# EAGLE design illumi-motherboard (EAGLE 6.2)
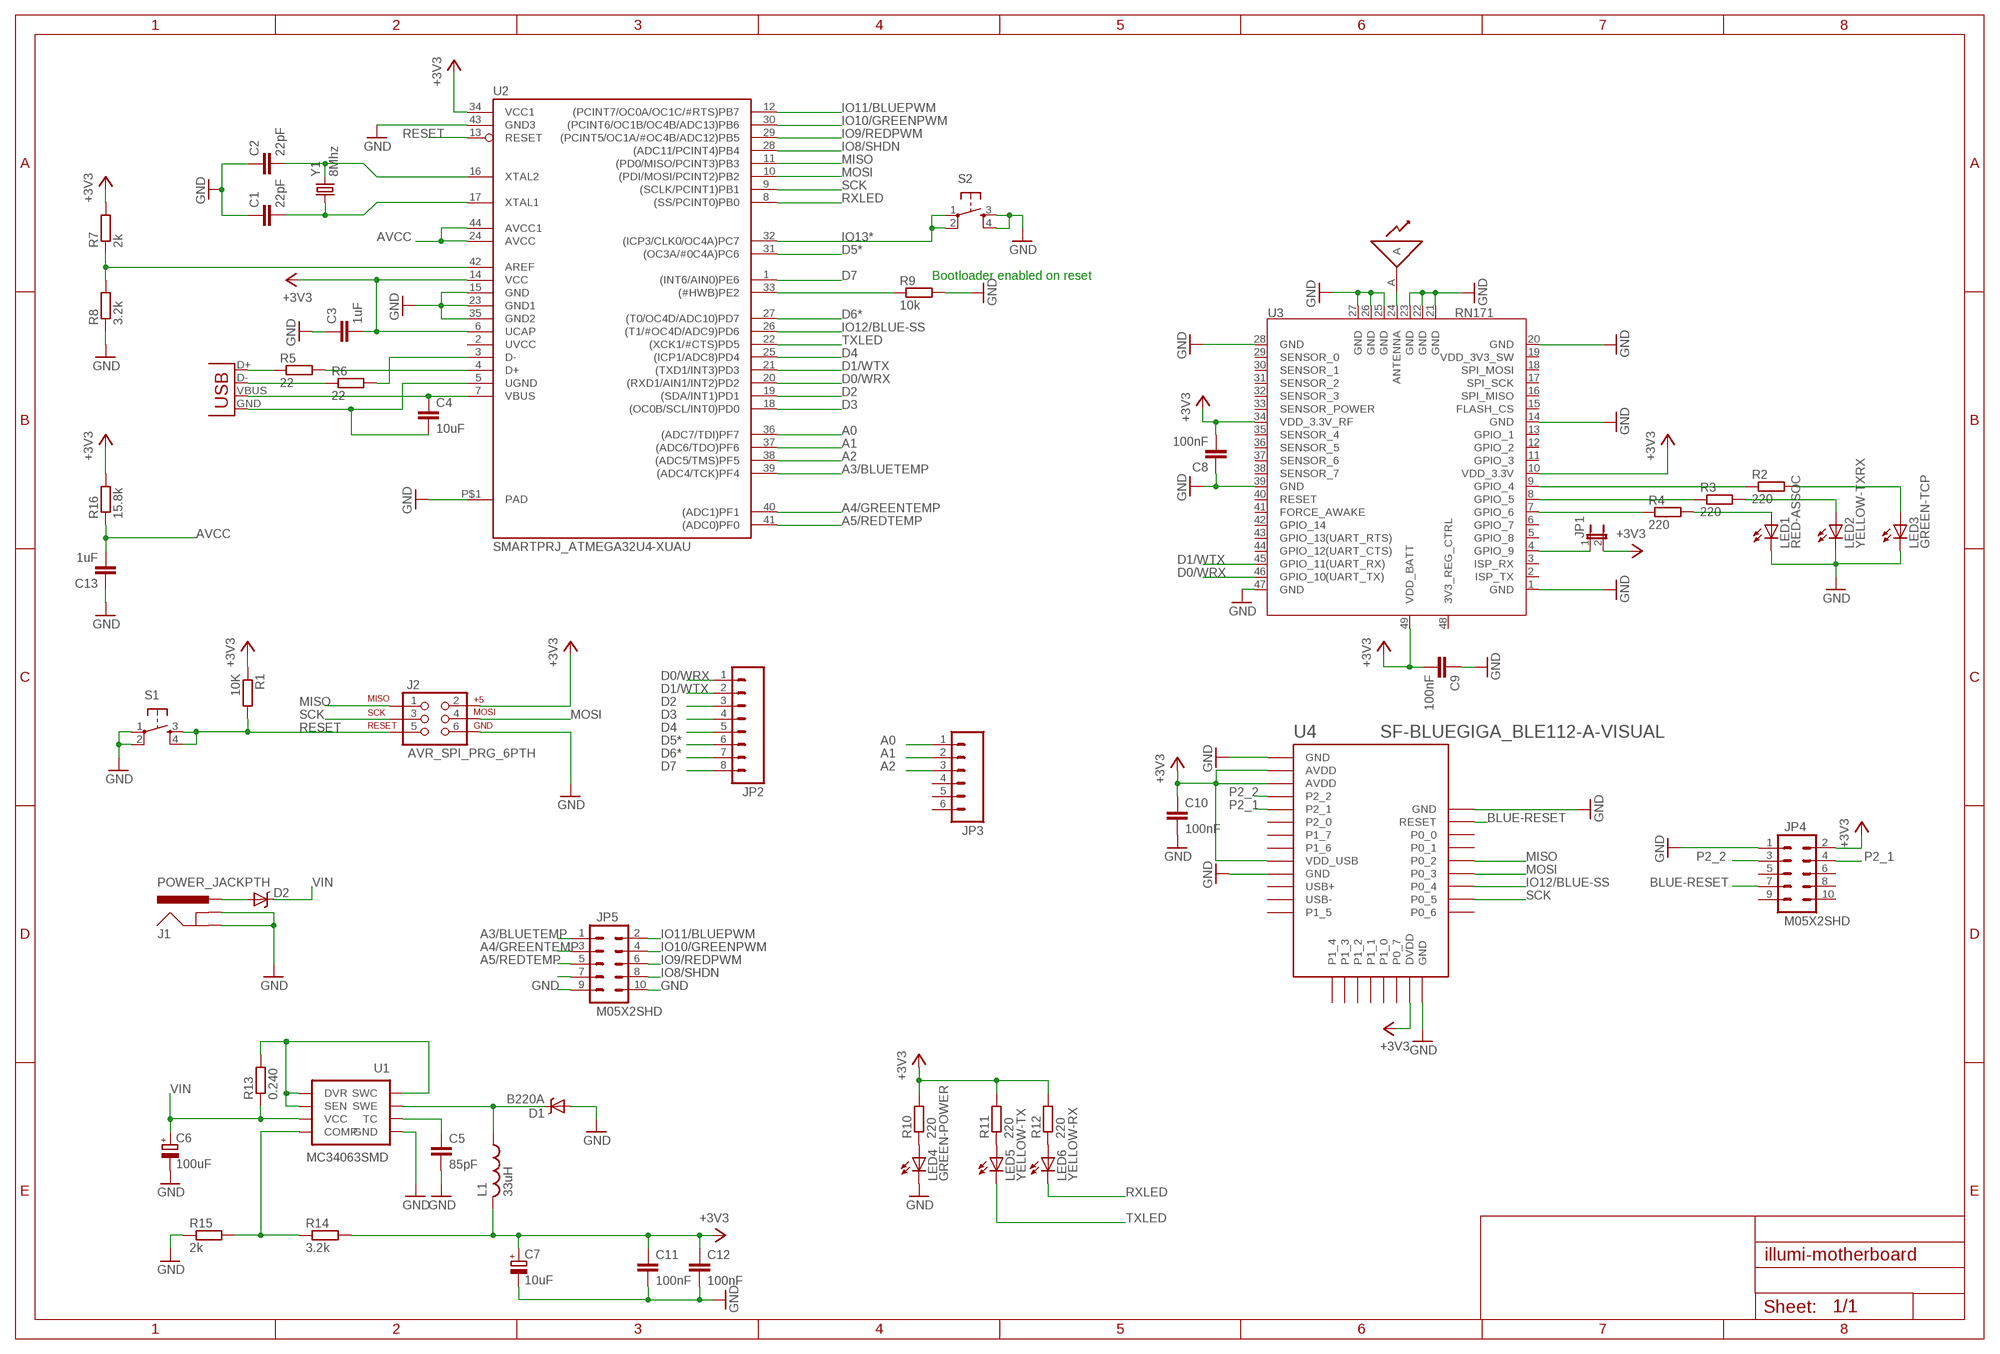
[diagram p0: schematic, sheet 1]

## Parts
A1  ANTENNAWIRE  [ANTENNA-WIRE]
C1  22pF  C-EUC0805  [C0805]
C2  22pF  C-EUC0805  [C0805]
C3  1uF  C-EUC0805  [C0805]
C4  10uF  C-EUC0805  [C0805]
C5  85pF  C-EUC0805  [C0805]
C6  100uF  CPOL-EUD  [PANASONIC_D]
C7  10uF  CPOL-EUSMCC  [SMC_C]
C8  100nF  C-EUC0805  [C0805]
C9  100nF  C-EUC0805  [C0805]
C10  100nF  C-EUC0805  [C0805]
C11  100nF  C-EUC0805  [C0805]
C12  100nF  C-EUC0805  [C0805]
C13  1uF  C-EUC0805  [C0805]
D1  B220A  DIODE-SCHOTTKYBIGPAD  [SMA-DIODE-BIG]
D2  DIODE-SCHOTTKYBIGPAD  [SMA-DIODE-BIG]
J1  POWER_JACKPTH  [POWER_JACK_PTH]
J2  AVR_SPI_PRG_6PTH  [2X3]
JP1  JUMPER-2PTH  [1X02]
JP2  M081X08  [1X08]
JP3  M06FEMALE_LOCK  [1X06_FEMALE_LOCK.010]
JP4  M05X2SHD  [2X5-SHROUDED]
JP5  M05X2SHD  [2X5-SHROUDED]
L1  33uH  L-USBOURNS-6045  [BOURNS-6045]
LED1  RED-ASSOC  LEDSML0805  [SML0805]
LED2  YELLOW-TXRX  LEDSML0805  [SML0805]
LED3  GREEN-TCP  LEDSML0805  [SML0805]
LED4  GREEN-POWER  LEDSML0805  [SML0805]
LED5  YELLOW-TX  LEDSML0805  [SML0805]
LED6  YELLOW-RX  LEDSML0805  [SML0805]
R1  10K  R-EU_R0805  [R0805]
R2  220  R-EU_R0805  [R0805]
R3  220  R-EU_R0805  [R0805]
R4  220  R-EU_R0805  [R0805]
R5  22  R-EU_R0805  [R0805]
R6  22  R-EU_R0805  [R0805]
R7  2k  R-EU_R0805  [R0805]
R8  3.2k  R-EU_R0805  [R0805]
R9  10k  R-EU_R0805  [R0805]
R10  220  R-EU_R0805  [R0805]
R11  220  R-EU_R0805  [R0805]
R12  220  R-EU_R0805  [R0805]
R13  0.240  R-EU_R1206  [R1206]
R14  3.2k  R-EU_R0805  [R0805]
R15  2k  R-EU_R0805  [R0805]
R16  15.8k  R-EU_R0805  [R0805]
S1  TAC_SWITCHB3FS  [OMRON-B3FS]
S2  TAC_SWITCHB3FS  [OMRON-B3FS]
U1  MC34063SMD  [SO08]
U2  SMARTPRJ_ATMEGA32U4-XUAU  [SMARTPRJ_TQFP44-PAD]
U3  RN171  MODULE_WIFI-RN-171  [MODULE_49P-1.27-26.67X17.78]
U4  SF-BLUEGIGA_BLE112-A-VISUAL  [SF-BLUEGIGA_BLE112-A]
X1  USB-MICROB  [USB-MICROB]
Y1  8Mhz  CRYSTALHC49US  [HC49US]

## Nets
+3V3: C3.2 C7.+ C8.2 C9.2 C10.1 C11.1 C12.1 J2.2 JP1.2 JP4.2 L1.P$2 R1.1 R7.2 R10.2 R11.2 R12.2 R14.2 R16.2 U2.6(UCAP) U2.14(VCC) U2.34(VCC1) U3.10(VDD_3.3V) U3.34(VDD_3.3V_RF) U3.49(VDD_BATT) U4.AVDD1(AVDD) U4.AVDD2(AVDD) U4.DVDD U4.VDD_USB
A0: JP3.1 U2.36((ADC7/TDI)PF7)
A1: JP3.2 U2.37((ADC6/TDO)PF6)
A2: JP3.3 U2.38((ADC5/TMS)PF5)
A3/BLUETEMP: JP5.1 U2.39((ADC4/TCK)PF4)
A4/GREENTEMP: JP5.3 U2.40((ADC1)PF1)
A5/REDTEMP: JP5.5 U2.41((ADC0)PF0)
AVCC: C13.2 R16.1 U2.24(AVCC) U2.44(AVCC1)
BLUE-RESET: JP4.7 U4.RESET
D0/WRX: JP2.1 U2.20((RXD1/AIN1/INT2)PD2) U3.46(GPIO_10(UART_TX))
D1/WTX: JP2.2 U2.21((TXD1/INT3)PD3) U3.45(GPIO_11(UART_RX))
D2: JP2.3 U2.19((SDA/INT1)PD1)
D3: JP2.4 U2.18((OC0B/SCL/INT0)PD0)
D4: JP2.5 U2.25((ICP1/ADC8)PD4)
D5*: JP2.6 U2.31((OC3A/#0C4A)PC6)
D6*: JP2.7 U2.27((T0/OC4D/ADC10)PD7)
D7: JP2.8 U2.1((INT6/AIN0)PE6)
GND: C1.1 C2.1 C3.1 C5.2 C6.- C7.- C8.1 C9.1 C10.2 C11.2 C12.2 C13.1 D1.A J1.GND J1.GNDBREAK J2.6 JP4.1 JP5.9 JP5.10 LED1.C LED2.C LED3.C LED4.C R8.1 R9.2 R15.1 S1.1 S1.2 S2.3 S2.4 U1.4(GND) U2.15(GND) U2.23(GND1) U2.35(GND2) U2.43(GND3) U2.P$1(PAD) U3.1(GND) U3.14(GND) U3.20(GND) U3.21(GND) U3.22(GND) U3.23(GND) U3.25(GND) U3.26(GND) U3.27(GND) U3.28(GND) U3.39(GND) U3.47(GND) U4.GND1(GND) U4.GND2(GND) U4.GND3(GND) U4.GND4(GND)
IO8/SHDN: JP5.8 U2.28((ADC11/PCINT4)PB4)
IO9/REDPWM: JP5.6 U2.29((PCINT5/OC1A/#OC4B/ADC12)PB5)
IO10/GREENPWM: JP5.4 U2.30((PCINT6/OC1B/OC4B/ADC13)PB6)
IO11/BLUEPWM: JP5.2 U2.12((PCINT7/OC0A/OC1C/#RTS)PB7)
IO12/BLUE-SS: U2.26((T1/#OC4D/ADC9)PD6) U4.P0_4
IO13*: S2.1 S2.2 U2.32((ICP3/CLK0/OC4A)PC7)
MISO: J2.1 U2.11((PD0/MISO/PCINT3)PB3) U4.P0_2
MOSI: J2.4 U2.10((PDI/MOSI/PCINT2)PB2) U4.P0_3
N$1: LED4.A R10.1
N$2: A1.A U3.24(ANTENNA)
N$3: R2.1 U3.9(GPIO_4)
N$4: R3.1 U3.8(GPIO_5)
N$5: R4.1 U3.7(GPIO_6)
N$6: LED1.A R4.2
N$7: LED2.A R3.2
N$8: LED3.A R2.2
N$9: C4.2 U2.5(UGND) X1.GND
N$10: R5.1 X1.D+
N$11: JP1.1 U3.4(GPIO_9)
N$12: R6.1 X1.D-
N$13: C4.1 U2.7(VBUS) X1.VBUS
N$14: R5.2 U2.4(D+)
N$15: R6.2 U2.3(D-)
N$16: R7.1 R8.2 U2.42(AREF)
N$17: LED5.A R11.1
N$18: LED6.A R12.1
N$19: JP5.7
N$20: R9.1 U2.33((#HWB)PE2)
N$21: R13.2 U1.1(SWC) U1.7(SEN) U1.8(DVR)
N$23: D1.C L1.P$1 U1.2(SWE)
N$25: C5.1 U1.3(TC)
N$26: R14.1 R15.2 U1.5(COMP)
N$29: D2.A J1.PWR
P2_1: JP4.4 U4.P2_1
P2_2: JP4.3 U4.P2_2
RESET: J2.5 R1.2 S1.3 S1.4 U2.13(RESET)
RXLED: LED6.C U2.8((SS/PCINT0)PB0)
SCK: J2.3 U2.9((SCLK/PCINT1)PB1) U4.P0_5
TXLED: LED5.C U2.22((XCK1/#CTS)PD5)
VIN: C6.+ D2.C R13.1 U1.6(VCC)
XTAL1: C1.2 U2.17(XTAL1) Y1.1
XTAL2: C2.2 U2.16(XTAL2) Y1.2
Unconnected: JP3.4 JP3.5 JP3.6 JP4.5 JP4.6 JP4.8 JP4.9 JP4.10 U3.2(ISP_TX) U3.3(ISP_RX) U3.5(GPIO_8) U3.6(GPIO_7) U3.11(GPIO_3) U3.12(GPIO_2) U3.13(GPIO_1) U3.15(FLASH_CS) U3.16(SPI_MISO) U3.17(SPI_SCK) U3.18(SPI_MOSI) U3.19(VDD_3V3_SW) U3.29(SENSOR_0) U3.30(SENSOR_1) U3.31(SENSOR_2) U3.32(SENSOR_3) U3.33(SENSOR_POWER) U3.35(SENSOR_4) U3.36(SENSOR_5) U3.37(SENSOR_6) U3.38(SENSOR_7) U3.40(RESET) U3.41(FORCE_AWAKE) U3.42(GPIO_14) U3.43(GPIO_13(UART_RTS)) U3.44(GPIO_12(UART_CTS)) U3.48(3V3_REG_CTRL) U4.P0_0 U4.P0_1 U4.P0_6 U4.P0_7 U4.P1_0 U4.P1_1 U4.P1_2 U4.P1_3 U4.P1_4 U4.P1_5 U4.P1_6 U4.P1_7 U4.P2_0 U4.USB+ U4.USB-

## Notes on the sheet
- Bootloader enabled on reset

## Power pins joined to a net without a drawn wire
UVCC: U2.2(UVCC)

## Library data of the parts
A1 = antenna:ANTENNA
C1-C5 C8-C13 = rcl:C-EU: CAPACITOR, European symbol
C6 C7 = rcl:CPOL-EU: POLARIZED CAPACITOR, European symbol
D1 D2 = diode-schottky:DIODE-SCHOTTKY
J1 = SparkFun:POWER_JACK: Power Jack This is the standard 5.5mm barrel jack for power. The PTH is the most common, proven, reliable, footprint. All others are experimental. The Slot footprint only works if the mill layer is transmitted to the PCB fab house so be warned. Spark Fun Electronics SKU : PRT-00119. Mating wall wart : TOL-00298 (and others)
J2 = SparkFun:AVR_SPI_PRG_6: AVR ISP 6 Pin This is the reduced ISP connector for AVR programming. Common on Arduino. This footprint will take up less PCB space and can be used with a 10-pin to 6-pin adapter such as SKU: BOB-08508
JP1 = SparkFun:JUMPER-2: Jumper Basic 0.1" spaced jumper. Use with breakaway headers.
JP2 = SparkFun:M08: Header 8 Standard 8-pin 0.1" header. Use with straight break away headers (SKU : PRT-00116), right angle break away headers (PRT-00553), swiss pins (PRT-00743), machine pins (PRT-00117), and female headers (PRT-00115).
JP3 = SparkFun:M06: Header 6 Standard 6-pin 0.1" header. Use with straight break away headers (SKU : PRT-00116), right angle break away headers (PRT-00553), swiss pins (PRT-00743), machine pins (PRT-00117), and female headers (PRT-00115). Molex polarized connector foot print use with SKU : PRT-08094 with associated crimp pins and housings. NOTES ON THE VARIANTS LOCK and LOCK_LONGPADS... This footprint was designed to help hold the alignment of a through-hole component (i.e. 6-pin header) while soldering it into place. You may notice that each hole has been shifted either up or down by 0.005 of an inch from it's more standard position (which is a perfectly straight line). This slight alteration caused the pins (the squares in the middle) to touch the edges of the holes. Because they are alternating, it causes a "brace" to hold the component in place. 0.005 has proven to be the perfect amount of "off-center" position when using our standard breakaway headers. Although looks a little odd when you look at the bare footprint, once you have a header in there, the alteration is very hard to notice. Also, if you push a header all the way into place, it is covered up entirely on the bottom side. This idea of altering the position of holes to aid alignment will be further integrated into the Sparkfun Library for other footprints. It can help hold any component with 3 or more connection pins.
JP4 JP5 = SparkFun:M05X2: Header 5x2 Standard 10-pin dual row 0.1" header. Commonly used with AVR-ISP. Use with Spark Fun Electronics SKU: PRT-00778
L1 = inductors:L-US: INDUCTOR, American symbol
LED1-LED6 = led:LED: LED OSRAM: - CHIPLED LG R971, LG N971, LY N971, LG Q971, LY Q971, LO R971, LY R971 LH N974, LH R974 LS Q976, LO Q976, LY Q976 LO Q996 - Hyper CHIPLED LW Q18S LB Q993, LB Q99A, LB R99A - SideLED LS A670, LO A670, LY A670, LG A670, LP A670 LB A673, LV A673, LT A673, LW A673 LH A674 LY A675 LS A676, LA A676, LO A676, LY A676, LW A676 LS A679, LY A679, LG A679 - Hyper Micro SIDELED® LS Y876, LA Y876, LO Y876, LY Y876 LT Y87S - SmartLED LW L88C, LW L88S LB L89C, LB L89S, LG L890 LS L89K, LO L89K, LY L89K LS L896, LA L896, LO L896, LY L896 - TOPLED LS T670, LO T670, LY T670, LG T670, LP T670 LSG T670, LSP T670, LSY T670, LOP T670, LYG T670 LG T671, LOG T671, LSG T671 LB T673, LV T673, LT T673, LW T673 LH T674 LS T676, LA T676, LO T676, LY T676, LB T676, LH T676, LSB T676, LW T676 LB T67C, LV T67C, LT T67C, LS T67K, LO T67K, LY T67K, LW E67C LS E67B, LA E67B, LO E67B, LY E67B, LB E67C, LV E67C, LT E67C LW T67C LS T679, LY T679, LG T679 LS T770, LO T770, LY T770, LG T770, LP T770 LB T773, LV T773, LT T773, LW T773 LH T774 LS E675, LA E675, LY E675, LS T675 LS T776, LA T776, LO T776, LY T776, LB T776 LHGB T686 LT T68C, LB T68C - Hyper Mini TOPLED® LB M676 - Mini TOPLED Santana® LG M470 LS M47K, LO M47K, LY M47K Source: http://www.osram.convergy.de LUXEON: - LUMILED® LXK2-PW12-R00, LXK2-PW12-S00, LXK2-PW14-U00, LXK2-PW14-V00 LXK2-PM12-R00, LXK2-PM12-S00, LXK2-PM14-U00 LXK2-PE12-Q00, LXK2-PE12-R00, LXK2-PE12-S00, LXK2-PE14-T00, LXK2-PE14-U00 LXK2-PB12-K00, LXK2-PB12-L00, LXK2-PB12-M00, LXK2-PB14-N00, LXK2-PB14-P00, LXK2-PB14-Q00 LXK2-PR12-L00, LXK2-PR12-M00, LXK2-PR14-Q00, LXK2-PR14-R00 LXK2-PD12-Q00, LXK2-PD12-R00, LXK2-PD12-S00 LXK2-PH12-R00, LXK2-PH12-S00 LXK2-PL12-P00, LXK2-PL12-Q00, LXK2-PL12-R00 Source: www.luxeon.com KINGBRIGHT: KA-3528ASYC Source: www.kingbright.com
R1-R8 R10-R15 = rcl:R-EU_: RESISTOR, European symbol
R9 R16 = resistor:R-EU_: RESISTOR, European symbol
S1 S2 = omron-b3fs:TAC_SWITCH: Momentary Switch Button commonly used for reset or general input. Spark Fun Electronics SKU : COM-00097
U1 = SparkFun:MC34063
U2 = atmega32u4:SMARTPRJ_ATMEGA32U4-XU
U3 = seeedstudio-rn171:MODULE_WIFI-RN-171: WIFLY GSX 802.11 b/g wireless LAN Module
U4 = ble112:SF-BLUEGIGA_BLE112-A-VISUAL: Bluetooth Low Energy single-mode module - Bluetooth 4.0, chip antenna
X1 = SparkFun:USB: USB Connectors USB-B-PTH is fully proven SKU : PRT-00139 USB-miniB is fully proven SKU : PRT-00587 USB-A-PCB is untested. USB-A-H is throughly reviewed, but untested. Spark Fun Electronics SKU : PRT-00437 USB-B-SMT is throughly reviewed, but untested. Needs silkscreen touching up. USB-A-S has not been used/tested USB-MB-H has not been used/tested
Y1 = SparkFun:CRYSTAL: Crystals Various standard crystals. Proven footprints. Spark Fun Electronics SKU : COM-00534

## Board
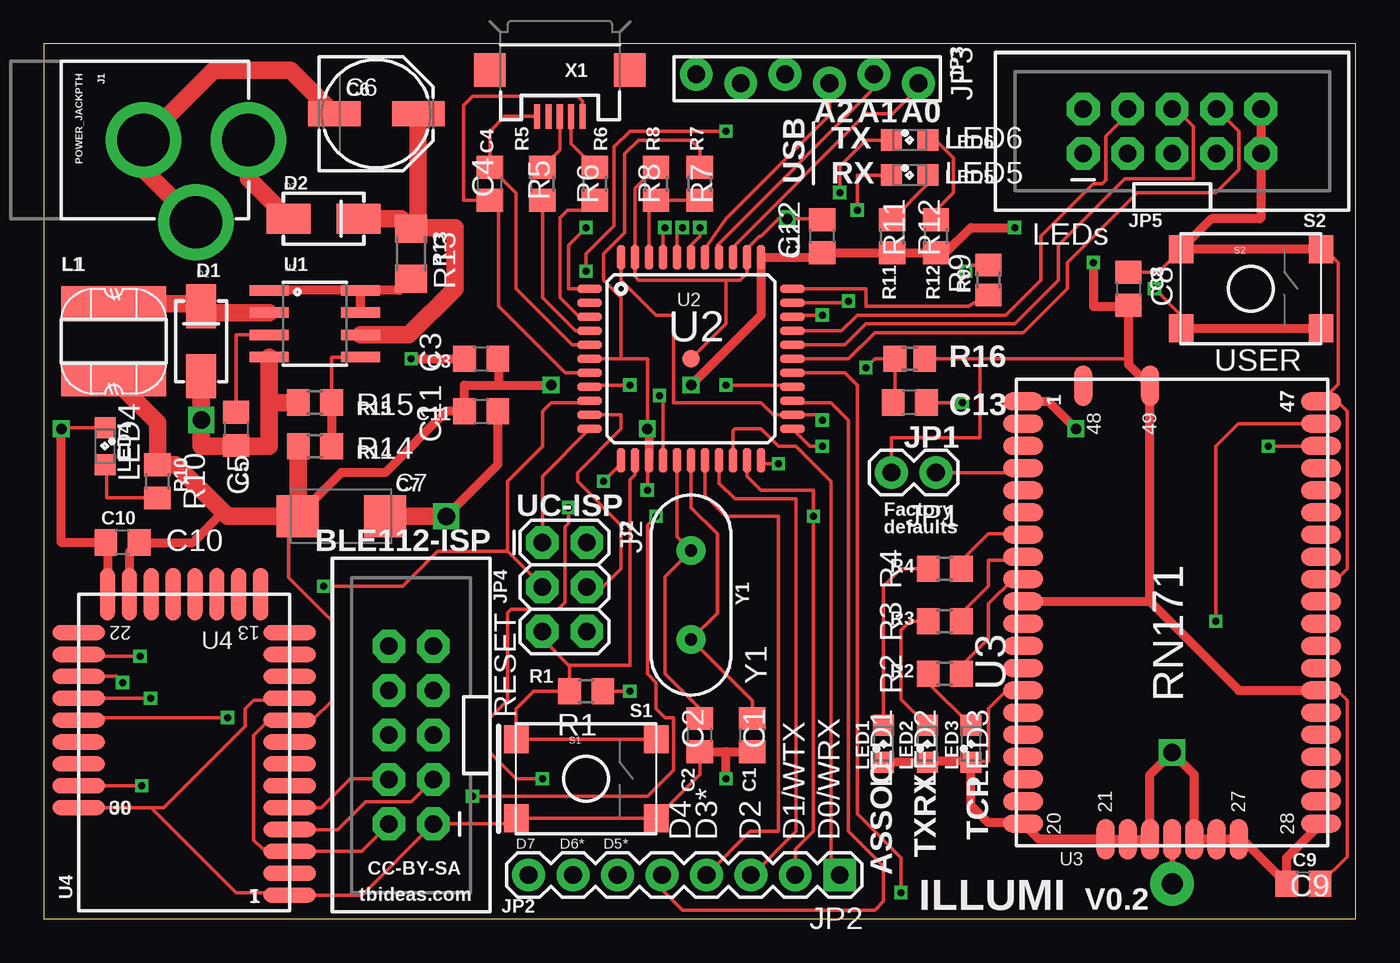
[diagram p1: board, top side]
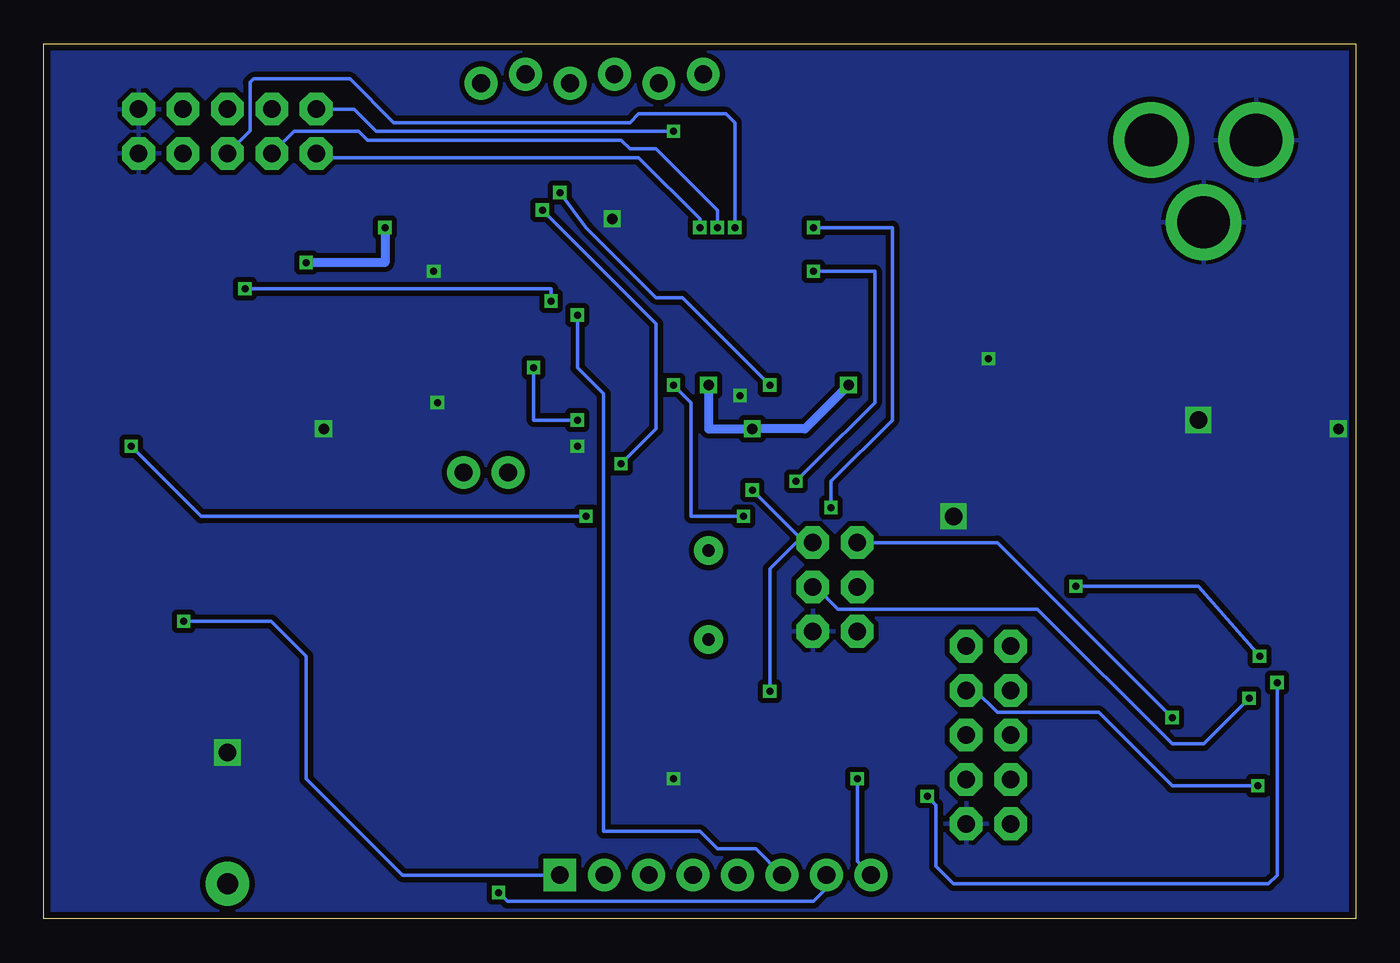
[diagram p2: board, bottom side, seen from below]

Size 75 x 50 mm. Coordinates in mm from the lower left corner, seen from the top.
Outline: 0,0 75,0 75,50 0,50 0,0
Copper layers (1*16): Top 0.0356mm / dielectric 1.5011mm / Bottom 0.0356mm
Design rules: minimum track width 6mil, minimum drill 13mil, track to track 6mil, track to pad 6mil, pad to pad 6mil, via to via 6mil, smd to smd 6mil, copper to edge 15mil, drill to drill 6mil, minimum pad ring 7mil, minimum via ring 7mil, stop-mask expansion 4mil, vias tented up to drill 0mil, thermal gap 10mil

### Footprints (pad centres in the part's own frame; a part is rotated, then mirrored left to right if it is on the bottom)
ANTENNA-WIRE = drill 1.2 pad 2.5: A 0,0
C0805 = smd 1.3 x 1.5: 1 -0.95,0; 2 0.95,0
PANASONIC_D = smd 3 x 1.4: + 2.4,0; - -2.4,0
SMC_C = smd 2.4 x 2.4: + -2.5,0; - 2.5,0
SMA-DIODE-BIG = smd 2.5 x 1.7: A -2,0; C 2,0
POWER_JACK_PTH = drill 2.997 pad 4.318: GND 0,7.7; GNDBREAK 4.7,10.7; PWR 0,13.7
2X3 = drill 1.016 pad 1.88 octagon: 1 0,0; 2 0,2.54; 3 2.54,0; 4 2.54,2.54; 5 5.08,0; 6 5.08,2.54
1X02 = drill 1.016 pad 1.88: 1 0,0; 2 2.54,0
1X08 = drill 1.016 pad 1.88 square: 1 0,0 | drill 1.016 pad 1.88: 2 2.54,0; 3 5.08,0; 4 7.62,0; 5 10.16,0; 6 12.7,0; 7 15.24,0; 8 17.78,0
1X06_FEMALE_LOCK.010 = drill 1.016 pad 1.88: 1 0,0.254; 2 2.54,-0.254; 3 5.08,0.254; 4 7.62,-0.254; 5 10.16,0.254; 6 12.7,-0.254
2X5-SHROUDED = drill 1.016 pad 1.88 octagon: 1 -1.27,5.08; 2 1.27,5.08; 3 -1.27,2.54; 4 1.27,2.54; 5 -1.27,0; 6 1.27,0; 7 -1.27,-2.54; 8 1.27,-2.54; 9 -1.27,-5.08; 10 1.27,-5.08
BOURNS-6045 = smd 2 x 6: P$1 -2.15,0; P$2 2.15,0
SML0805 = smd 1.2 x 1.2: A 1.05,0; C -1.05,0
R0805 = smd 1.3 x 1.5: 1 -0.95,0; 2 0.95,0
R0805' = smd 1.3 x 1.5: 1 -0.85,0; 2 0.85,0
R1206 = smd 1.6 x 1.803: 1 -1.422,0; 2 1.422,0
OMRON-B3FS = smd 1.4 x 1.6: 1 4,-2.25; 2 -4,-2.25; 3 4,2.25; 4 -4,2.25
SO08 = smd 0.61 x 2.21: 1 -1.905,-2.616; 2 -0.635,-2.616; 3 0.635,-2.616; 4 1.905,-2.616; 5 1.905,2.616; 6 0.635,2.616; 7 -0.635,2.616; 8 -1.905,2.616
SMARTPRJ_TQFP44-PAD = smd 1.4 x 0.45: 1 -5.8,4; 2 -5.8,3.2; 3 -5.8,2.4; 4 -5.8,1.6; 5 -5.8,0.8; 6 -5.8,0; 7 -5.8,-0.8; 8 -5.8,-1.6; 9 -5.8,-2.4; 10 -5.8,-3.2; 11 -5.8,-4; 23 5.8,-4; 24 5.8,-3.2; 25 5.8,-2.4; 26 5.8,-1.6; 27 5.8,-0.8; 28 5.8,0; 29 5.8,0.8; 30 5.8,1.6; 31 5.8,2.4; 32 5.8,3.2; 33 5.8,4 | smd 0.45 x 1.4: 12 -4,-5.8; 13 -3.2,-5.8; 14 -2.4,-5.8; 15 -1.6,-5.8; 16 -0.8,-5.8; 17 0,-5.8; 18 0.8,-5.8; 19 1.6,-5.8; 20 2.4,-5.8; 21 3.2,-5.8; 22 4,-5.8; 34 4,5.8; 35 3.2,5.8; 36 2.4,5.8; 37 1.6,5.8; 38 0.8,5.8; 39 0,5.8; 40 -0.8,5.8; 41 -1.6,5.8; 42 -2.4,5.8; 43 -3.2,5.8; 44 -4,5.8 | smd 1 x 1: P$1 0,0
MODULE_49P-1.27-26.67X17.78 = smd 1.016 x 2.286: 1 12.065,8.509; 2 10.795,8.509; 3 9.525,8.509; 4 8.255,8.509; 5 6.985,8.509; 6 5.715,8.509; 7 4.445,8.509; 8 3.175,8.509; 9 1.905,8.509; 10 0.635,8.509; 11 -0.635,8.509; 12 -1.905,8.509; 13 -3.175,8.509; 14 -4.445,8.509; 15 -5.715,8.509; 16 -6.985,8.509; 17 -8.255,8.509; 18 -9.525,8.509; 19 -10.795,8.509; 20 -12.065,8.509; 28 -12.065,-8.509; 29 -10.795,-8.509; 30 -9.525,-8.509; 31 -8.255,-8.509; 32 -6.985,-8.509; 33 -5.715,-8.509; 34 -4.445,-8.509; 35 -3.175,-8.509; 36 -1.905,-8.509; 37 -0.635,-8.509; 38 0.635,-8.509; 39 1.905,-8.509; 40 3.175,-8.509; 41 4.445,-8.509; 42 5.715,-8.509; 43 6.985,-8.509; 44 8.255,-8.509; 45 9.525,-8.509; 46 10.795,-8.509; 47 12.065,-8.509 | smd 2.286 x 1.016: 21 -12.954,3.81; 22 -12.954,2.54; 23 -12.954,1.27; 24 -12.954,0; 25 -12.954,-1.27; 26 -12.954,-2.54; 27 -12.954,-3.81; 48 12.954,5.08; 49 12.954,1.27
SF-BLUEGIGA_BLE112-A = smd 3 x 0.85: AVDD1 -6.05,6.9; AVDD2 -6.05,5.65; GND1 -6.05,8.15; GND2 -6.05,-3.1; GND4 6,3.15; P0_0 6,0.65; P0_1 6,-0.6; P0_2 6,-1.85; P0_3 6,-3.1; P0_4 6,-4.35; P0_5 6,-5.6; P0_6 6,-6.85; P1_5 -6.05,-6.85; P1_6 -6.05,-0.6; P1_7 -6.05,0.65; P2_0 -6.05,1.9; P2_1 -6.05,3.15; P2_2 -6.05,4.4; RESET 6,1.9; USB+ -6.05,-4.35; USB- -6.05,-5.6; VDD_USB -6.05,-1.85 | smd 0.85 x 3: DVDD 3.1,-9.05; GND3 4.35,-9.05; P0_7 1.85,-9.05; P1_0 0.6,-9.05; P1_1 -0.65,-9.05; P1_2 -1.9,-9.05; P1_3 -3.15,-9.05; P1_4 -4.4,-9.05
USB-MICROB = smd 0.35 x 1.4: D+ 0,2.65; D- -0.65,2.65; GND 1.3,2.65; ID 0.65,2.65; VBUS -1.3,2.65 | smd 1.8 x 1.9: MT1 -4,0; MT2 4,0
HC49US = drill 0.7 pad 1.651: 1 -2.54,0; 2 2.54,0

### Placement (x,y rotation side)
A1  64.5,2 0 top
C1  40.5,10.5 90 top
C2  37.5,10.5 90 top
C3  25,32 0 top
C4  25.5,42 90 top
C5  11,28 270 top
C6  19,46 0 top
C7  17,23 0 top
C8  62,36 270 top
C9  72,2 0 top
C10  4.5,21.5 180 top
C11  25,29 0 top
C12  44.5,39 90 top
C13  49.5,29.5 180 top
D1  9,33 90 top
D2  16,40 0 top
J1  -2,44.5 270 top
J2  28.5,21.5 270 top
JP1  51,25.5 180 top
JP2  45.5,2.5 180 top
JP3  50,48 180 top
JP4  21,10.5 180 top
JP5  64.5,45 90 top
L1  4,33 270 top
LED1  48,10 90 top
LED2  50.5,10 90 top
LED3  53,10 90 top
LED4  3.5,27 270 top
LED5  49.5,42.5 0 top
LED6  49.5,44.5 0 top
R1  31,13 180 top
R2  51.5,14 180 top
R3  51.5,17 180 top
R4  51.5,20 180 top
R5  28.5,42 270 top
R6  31.5,42 270 top
R7  37.5,42 90 top
R8  35,42 270 top
R9  10k  [R0805']  54,36.5 90 top
R10  6.5,25 90 top
R11  48.5,39 270 top
R12  51,39 270 top
R13  21,38 270 top
R14  15.5,27 180 top
R15  15.5,29.5 0 top
R16  15.8k  [R0805']  49.5,32 0 top
S1  31,8 0 top
S2  69,36 0 top
U1  15.5,34 270 top
U2  37,32 0 top
U3  64.5,17.5 90 top
U4  8,9.5 180 top
X1  29.5,48.5 180 top
Y1  37,18.5 90 top

### Tracks (layer width: path | path; a pad name or v marks a point on that pad's centre or on a via)
+3V3  (via drill 0.4, 0.6)
  Top 0.2: 44.25,37.8 C12.1 | U4.AVDD2 18.16,3.85 JP4.2 | C9.2 74.5,3.55 74.5,12.5 73.94,13.05 U3.34 | U4.VDD_USB 15.35,11.35 | 15.35,11.35 16.5,12.5 16.5,17 16,17.5 14,19.5 14,23 | U4.AVDD2 U4.AVDD1 | 15.35,11.35 12.85,11.35 12,10.5 12,4.5 12.5,4 13.9,4 U4.AVDD2 | U2.6 33,32 | 33,32 34.5,32 v34.5,28 | R7.2 37.5,44 37,44.5 34,44.5 33.2,43.7 33.2,39.2 33,39 32,38 32,37 32,36.5 33,35.5 33,32 | U2.14 34.5,26.1 v34.5,24.5 | R1.1 v33.5,13 | JP1.2 48.46,27.5 53.5,27.5 53.5,32 R16.2 62,32
  Top 0.5: U4.DVDD 4.9,20.95 C10.1 8.5,21.5 10.25,23.25 | C7.+ 17,25.5 19.5,25.5 23,29 C11.1 24.05,30.5 26,30.5 | 26,30.5 v29,30.5 | v34.5,28 34.6,27.9 U2.14 | C3.2 26,31.95 26,30.5 | U3.10 63.23,18.14 | 63.23,18.14 U3.49 62,31.68 62,32 C8.2 arc-90 61.95,35 60,35 v60,37.5 | 63.23,18.14 68.31,13.05 U3.34 | v55.5,39.5 53,39.5 51.55,38.05 R12.2 R11.2 C12.1 44.25,37.8 U2.34 41,34.5 v37,30.5
  Top 1: L1.P$2 6.5,28.35 R10.2 7.55,25.95 10.25,23.25 10.5,23 14,23 C7.+ 14.55,23.45 R14.2
  Bottom 0.2: v34.5,24.5 31.5,21.5 J2.2 32,21.5 33.5,20 v33.5,13
  Bottom 0.5: v29,30.5 31.5,28 v34.5,28 37,28 v37,30.5 | v55.5,39.5 55.5,37.5 v60,37.5
A0
  Top 0.2: JP3.1 50,47.5 48.5,46 47,46 39.5,38.5 39.5,37.9 U2.36
A1
  Top 0.2: JP3.2 47.46,47.46 38.5,38.5 38.5,37.9 U2.37
A2
  Top 0.2: JP3.3 44.92,45.92 39,40 37.8,38.3 U2.38
A3/BLUETEMP  (via drill 0.4)
  Top 0.2: U2.39 37,38.5 37.5,39 v37.5,39.5
  Bottom 0.2: v37.5,39.5 37.5,40 41,43.5 59.19,43.5 JP5.1
A4/GREENTEMP  (via drill 0.4)
  Top 0.2: U2.40 36.2,39.2 v36.5,39.5
  Bottom 0.2: v36.5,39.5 36.5,40.5 40,44 41.5,44 42,44.5 56.5,44.5 57,45 60.69,45 JP5.3
A5/REDTEMP  (via drill 0.4)
  Top 0.2: U2.41 35.4,39.4 v35.5,39.5
  Bottom 0.2: v35.5,39.5 35.5,40.5 35.5,45.5 36,46 38,46 41,46 41.5,45.5 55,45.5 57.5,48 63,48 63.2,47.8 63.2,45.03 JP5.5
AVCC  (via drill 0.4)
  Top 0.2: U2.44 33,36.5 35,34.5 36,34.5 36,29.5 41,29.5 41.7,28.8 U2.24 44.5,28.8 v44.5,28.5 | v47,31.5 47.5,32 R16.1 48.65,29.6 C13.2
  Bottom 0.2: v44.5,28.5 47,28.5 v47,31.5
BLUE-RESET  (via drill 0.4)
  Top 0.2: v5.6,7.6 U4.RESET
  Bottom 0.2: JP4.7 21.74,13.04 20.5,11.8 14.8,11.8 14.7,11.8 10.5,7.6 v5.6,7.6
D0/WRX  (via drill 0.4)
  Top 0.2: U2.20 39.4,27.9 39.5,28 41,28 42,27 43,27 45,25 45,3.5 45.5,3 JP2.1 | U3.46 68.3,28.3 67,27 v67,17
  Bottom 0.2: v67,17 62,17 60,15 60,8 54.5,2.5 JP2.1
D1/WTX  (via drill 0.4)
  Top 0.2: U2.21 40.2,25.3 41,24.5 44,24.5 | 44,24.5 v44,23 | v44,23 44,5 42.96,3.96 JP2.2 | 44,24.5 v44,23 | v70,27 72.98,27 U3.45
  Bottom 0.2: v44,23 66,23 v70,27
D2
  Top 0.2: U2.19 38.6,24.9 39.5,24 43,24 43,5 40.5,2.5 JP2.3
D3
  Top 0.2: U2.18 37.8,24.2 39,23 42,23 42,5 40.38,5 JP2.4
D4
  Top 0.2: JP2.5 35.34,1.66 36.5,0.5 47.5,0.5 48,1 48,3 46,5 46,28.5 45,29.5 42.9,29.5 U2.25
D5*  (via drill 0.4)
  Top 0.2: U2.31 42.8,34.5 v44.5,34.5
  Bottom 0.2: v44.5,34.5 44.5,31.5 43,30 43,5 37.5,5 36.5,4 34.3,4 JP2.6
D6*  (via drill 0.4)
  Top 0.2: U2.27 45.8,31.2 46.5,30.5 46.5,6 49,3.5 v49,1.5
  Bottom 0.2: v49,1.5 48.5,1 31,1 30.26,1.74 JP2.7
D7  (via drill 0.4)
  Top 0.2: U2.1 30,36 30,36.5 30,38.5 v31,39.5 | v30,23.5 30,22.6 29.8,22.4 29.8,18.1 29.4,17.7 26.7,17.7 26.5,17.5 26.5,12.5 25.5,11.5 25.5,9.5 27,8 v28.5,8
  Bottom 0.2: v31,39.5 26.5,39.5 26.5,28.5 30,25 v30,23.5 | v28.5,8 28.5,3.28 JP2.8
GND  (via drill 0.4, 0.6, 1, 1 pad 1)
  Top 0.2: v1,28 1.05,28.05 LED4.C | R8.1 33.8,41.75 U2.43 33.8,36.7 34,36.5 39,36.5 | C8.1 63.7,36.95 S2.4 | LED2.C 50.5,9 | 52.95,9 LED3.C 53.05,9 54,9 54,12 55.05,13.05 U3.14 | 55.93,5.5 U3.20 | 70.86,2 C9.1 | U3.39 73.91,19.41 74.5,20 74.5,29 73.94,29.57 U3.47 74,30.56 74,37.5 73.25,38.25 S2.3 | U4.GND4 6.15,6.35 | 6.15,6.35 11,1.5 13.9,1.5 U4.GND1 18.2,1.35 JP4.1 26.67,5.42 S1.2 S1.1 37.5,8.25 C2.1 | 6.15,6.35 6.85,6.35 11.5,11 11.5,12 12,12.5 13.95,12.5 U4.GND2 | C12.2 44.45,40 v42.5,40 42,40 41,39 40.9,39 40.2,38.3 U2.35 40.2,36.9 39.8,36.5 39.5,36.5 39,36.5 | U2.P$1 39,34 39,36.5 | U2.23 43.8,27 v44.5,27 | C13.1 v52.5,29.5 | U2.15 35.4,29.9 v35.2,29.9 | R9.2 53.05,37.35 v52.7,37 | 11,27 C5.2
  Top 0.5: JP5.10 JP5.9 69.58,42.83 69.58,40.08 69.5,40 66.75,40 S2.4 | 64.9,38.35 S2.4 | U3.47 73.06,29.57 | S2.3 S2.4 | v1,28 1,21.5 C10.2 3.65,21.4 U4.GND3 | C7.- 19.95,23 | C11.2 25.95,25.95 v23,23 | U3.28 71.05,3.48 C9.1 68.5,4.55 U3.27 U3.26 U3.25 65.77,8.23 v64.5,9.5 63.23,8.23 U3.23 U3.22 U3.21 56.88,4.55 U3.20 | 55.93,5.5 54,5.5 53,6.5 LED3.C | 52.95,9 50.55,9 LED2.C LED1.C | U3.1 57.44,29.57 v59,28 | v21,32 C3.1 | v39,8 39,9.55 | C2.1 39,9.55 | 39,9.55 C1.1
  Top 1: J1.GNDBREAK 5.7,42.8 J1.GND 9.7,48.5 10,48.5 14.1,48.5 C6.- | D1.A v9,28.5 9,27 11,27 12.88,27 | 12.88,27 U1.4 | 12.88,27 12.88,29.5 R15.1 | 19.95,23 v23,23
  pour Bottom (isolate 0.3): 0,50 0,0 75,0 75,50
IO8/SHDN
  Top 0.2: U2.28 43,32 46,32 47.5,33.5 56,33.5 58.5,36 58.5,37.5 62.5,41.5 67,41.5 68.3,42.8 68.3,45 JP5.8
IO9/REDPWM
  Top 0.2: U2.29 45.8,32.8 47,34 55.5,34 57.5,36 58,36.5 58,37.5 58,38.5 61.8,42.3 65.7,42.3 65.7,45.3 64.73,46.27 JP5.6
IO10/GREENPWM
  Top 0.2: U2.30 45.6,33.6 46.5,34.5 55,34.5 56.5,36 57,36.5 57,39 60,42 60.5,42 60.7,42.2 60.7,44.7 61.96,45.96 JP5.4
IO11/BLUEPWM  (via drill 0.4)
  Top 0.2: v39,45 33.5,45 32.6,44.1 32.6,39.6 31,38 v31,37 | U2.12 33,26 v32,25
  Bottom 0.2: JP5.2 57.27,46.27 56,45 41,45 v39,45 | v31,37 27.5,37 27.5,29.5 31,26 v32,25
IO12/BLUE-SS  (via drill 0.4)
  Top 0.2: U2.26 42.7,30.5 v39,30.5 | v35,23 34.5,22.5 34.5,14 35,13.5 35,12 35.5,11.5 36,11.5 36,8.5 34.5,7 v24.5,7 | v4.5,13.5 4.15,13.85 U4.P0_4
  Bottom 0.2: v39,30.5 38,29.5 38,23 v35,23 | v24.5,7 24,6.5 24,3 23,2 5,2 4.5,2.5 4.5,13 v4.5,13.5
IO13*  (via drill 0.4)
  Top 0.2: S2.2 65,34.5 v63.5,36 | v46,35.3 45.6,35.2 U2.32
  Top 0.5: S2.2 S2.1
  Bottom 0.2: v63.5,36 46,36 v46,35.3
MISO  (via drill 0.4)
  Top 0.2: J2.1 28.5,25.3 U2.11 | v10.5,11.5 2.15,11.5 U4.P0_2
  Bottom 0.2: J2.1 20.5,21.5 v10.5,11.5
MOSI  (via drill 0.4)
  Top 0.2: J2.4 31.96,18.96 33,20 33,22.5 30.5,25 30.5,25.5 33,28 33,28.8 U2.10 | v6.1,12.6 U4.P0_3
  Bottom 0.2: J2.4 30.86,18.96 29.6,17.7 18.2,17.7 10.5,10 8.7,10 v6.1,12.6
N$1
  Top 0.2: LED4.A 3.6,26.05 3.6,24.05 R10.1
N$2
  Top 0.305: U3.24 A1.A
N$3
  Top 0.2: R2.1 52.45,14.45 54,16 54,18 55.5,19.5 55.9,19.5 U3.9
N$4
  Top 0.2: R3.1 52.45,17.45 54,19 54,20.5 55.82,20.5 U3.8
N$5
  Top 0.2: R4.1 52.45,20.45 54,22 55.94,22 U3.7
N$6
  Top 0.2: R4.2 49,20 48,19 LED1.A
N$7
  Top 0.2: R3.2 49.5,17 49,16.5 49,12.55 LED2.A
N$8
  Top 0.2: R2.2 50.55,13.5 LED3.A
N$9
  Top 0.2: X1.GND 26.35,45.85 25.5,45 C4.2 27,41.45 27,36 30.2,32.8 U2.5
N$10
  Top 0.2: X1.D+ 29.5,43.95 R5.1
N$11
  Top 0.2: JP1.1 55.74,25.5 U3.4
N$12
  Top 0.2: X1.D- 30.15,44.3 R6.1
N$13
  Top 0.2: X1.VBUS 30.8,46.7 30.5,47 24.5,47 24,46.5 24,41.05 C4.1 26,40.55 26,35 29.8,31.2 U2.7
N$14
  Top 0.2: R5.2 28.5,35.5 30,34 30.4,33.6 U2.4
N$15
  Top 0.2: R6.2 31.5,41 31.5,40.5 29.95,40.5 29.5,40.05 29.5,35.5 30.6,34.4 U2.3
N$16
  Top 0.2: U2.42 34.6,40.65 R8.2 R7.1
N$17
  Top 0.2: LED5.A 50.55,42 R11.1
N$18
  Top 0.2: R12.1 51,40.5 52,41.5 52,43.5 51,44.5 LED6.A
N$20
  Top 0.2: U2.33 47,36 47,35 52.85,35 R9.1
N$21
  Top 0.5: R13.2 20.33,35.91 U1.8 | U1.7 U1.8 | U1.8 U1.1
N$23
  Top 1: L1.P$1 8.85,35.15 D1.C 9.37,34.63 U1.2
N$25
  Top 0.2: C5.1 11,33.37 U1.3
N$26
  Top 0.2: U1.5 16.45,32.09 R15.2
  Top 0.5: R15.2 R14.1
N$29
  Top 1: J1.PWR 11.7,42.3 D2.A
P2_1
  Top 0.2: JP4.4 19.69,8 17.5,8 15.85,6.35 U4.P2_1
P2_2
  Top 0.2: U4.P2_2 16.8,5.1 18.4,6.7 18.5,6.7 21,6.7 JP4.3
RESET
  Top 0.2: U2.13 33.8,25.38 33.5,25.08 33.5,14.5 30,14.5 | J2.5 28.5,16 30,14.5 | 30,14.5 30.05,14.45 R1.2 28,13 27,12 S1.4 S1.3
RXLED  (via drill 0.4)
  Top 0.2: LED6.C 47,44.5 45.5,43 v45.5,41.5 | v33.5,30.5 31.3,30.5 U2.8
  Bottom 0.2: v45.5,41.5 44,39.5 40,35.5 38.5,35.5 v33.5,30.5
SCK  (via drill 0.4)
  Top 0.2: 26.5,21 26.5,25 28.5,27 28.5,29 29,29.5 31.1,29.5 U2.9 | J2.3 28.5,19 26.5,21 | 26.5,21 22.5,21 20.5,19 v16,19 | v5.5,15 2.1,15 U4.P0_5
  Bottom 0.2: v16,19 9,19 v5.5,15
TXLED  (via drill 0.4)
  Top 0.2: LED5.C 46.5,42.5 v46.5,40.5 | v42,26 41.2,26 U2.22
  Bottom 0.2: v46.5,40.5 44,38 40,34 40,28 v42,26
VIN
  Top 1: D2.C 20.42,40 R13.1 | U1.6 20.86,33.37 23.5,36 23.5,39.5 21.08,39.5 R13.1 | C6.+ 21.4,39.82 R13.1
XTAL1
  Top 0.2: U2.17 37,23.5 38.5,22 38.5,17.46 Y1.1 40.5,12.46 C1.2
XTAL2
  Top 0.2: U2.16 36.2,21.84 Y1.2 35.5,19.54 35.5,14 37.5,12 C2.2

### Text on the board
_tsilk: JP3 | X1 | POWER_JACKPTH | J1 | C6 | A2 | A1 | A0 | C4 | R5 | R6 | R8 | R7 | TX | LED6 | D2 | USB | RX | LED5 | JP5 | S2 | R13 | C12 | LEDs | L1 | D1 | U1 | C8 | R9 | U2 | R11 | R12 | C3 | R16 | USER | R15 | C11 | C13 | 1 | 47 | JP1 | LED4 | R14 | C5 | R10 | C7 | C10 | UC-ISP | J2 | Factory | defaults | BLE112-ISP | R4 | JP4 | Y1 | R3 | R1 | R2 | RESET | S1 | RN171 | LED1 | LED2 | LED3 | 30 | C2 | C1 | D7 | D6* | D5* | D4 | D3* | D2 | D1/WTX | D0/WRX | TXRX | TCP | C9 | U3 | U4 | 1 | CC-BY-SA | ASSOC | tbideas.com | JP2 | ILLUMI | V0.2
_tNames: JP3 | X1 | C6 | C4 | R5 | R6 | R8 | R7 | LED6 | LED5 | R13 | C12 | D1 | U1 | C8 | R9 | R11 | R12 | U2 | R16 | C3 | R15 | C13 | C11 | R14 | LED4 | C5 | C7 | R10 | J2 | C10 | R4 | R3 | R2 | Y1 | R1 | C1 | C2 | C9 | LED1 | LED2 | LED3 | U4